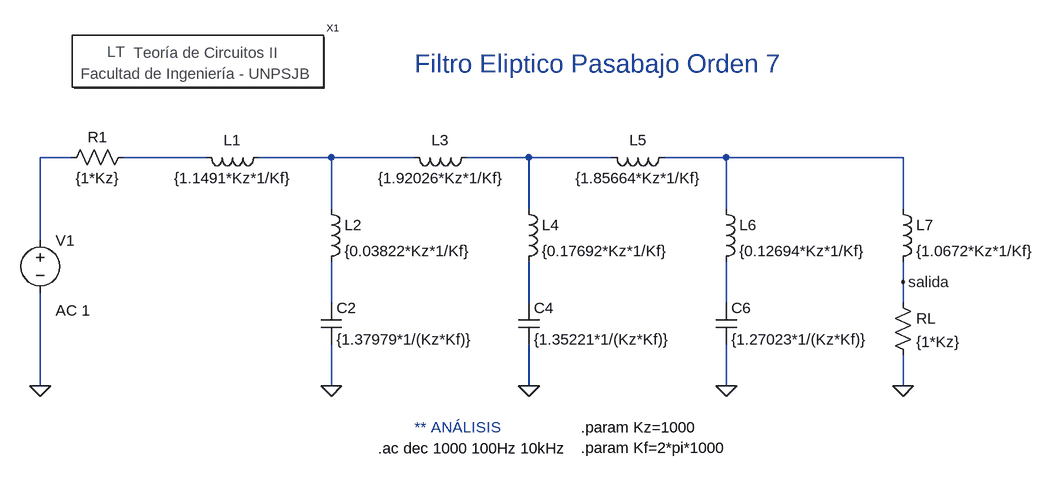
[diagram p0: schematic FiltroElipticoPasabajoOrden7.asc]
FiltroElipticoPasabajoOrden7.asc, the LTspice schematic file:
Version 4
SHEET 1 1536 680
WIRE 16 48 -32 48
WIRE 224 48 96 48
WIRE 416 48 304 48
WIRE 544 48 416 48
WIRE 720 48 624 48
WIRE 848 48 720 48
WIRE 1024 48 928 48
WIRE 1296 48 1024 48
WIRE 416 128 416 48
WIRE 720 128 720 48
WIRE 1024 128 1024 48
WIRE 1296 128 1296 48
WIRE -32 176 -32 48
WIRE 1296 240 1296 208
WIRE 416 272 416 208
WIRE 720 272 720 208
WIRE 1024 272 1024 208
WIRE 1296 272 1296 240
WIRE -32 400 -32 256
WIRE 416 400 416 336
WIRE 720 400 720 336
WIRE 1024 400 1024 336
WIRE 1296 400 1296 352
FLAG 416 400 0
FLAG 720 400 0
FLAG 1024 400 0
FLAG 1296 400 0
FLAG -32 400 0
FLAG 1296 240 salida
SYMBOL voltage -32 160 R0
WINDOW 123 24 124 Left 2
WINDOW 39 0 0 Left 0
SYMATTR InstName V1
SYMATTR Value ""
SYMATTR Value2 AC 1
SYMBOL res 112 32 R90
WINDOW 0 0 56 VBottom 2
WINDOW 3 32 56 VTop 2
SYMATTR InstName R1
SYMATTR Value {1*Kz}
SYMBOL ind 320 32 R90
WINDOW 0 5 56 VBottom 2
WINDOW 3 32 56 VTop 2
SYMATTR InstName L1
SYMATTR Value {1.1491*Kz*1/Kf}
SYMBOL ind 400 112 R0
SYMATTR InstName L2
SYMATTR Value {0.03822*Kz*1/Kf}
SYMBOL cap 400 272 R0
SYMATTR InstName C2
SYMATTR Value {1.37979*1/(Kz*Kf)}
SYMBOL ind 640 32 R90
WINDOW 0 5 56 VBottom 2
WINDOW 3 32 56 VTop 2
SYMATTR InstName L3
SYMATTR Value {1.92026*Kz*1/Kf}
SYMBOL ind 704 112 R0
SYMATTR InstName L4
SYMATTR Value {0.17692*Kz*1/Kf}
SYMBOL cap 704 272 R0
SYMATTR InstName C4
SYMATTR Value {1.35221*1/(Kz*Kf)}
SYMBOL ind 944 32 R90
WINDOW 0 5 56 VBottom 2
WINDOW 3 32 56 VTop 2
SYMATTR InstName L5
SYMATTR Value {1.85664*Kz*1/Kf}
SYMBOL ind 1008 112 R0
SYMATTR InstName L6
SYMATTR Value {0.12694*Kz*1/Kf}
SYMBOL cap 1008 272 R0
SYMATTR InstName C6
SYMATTR Value {1.27023*1/(Kz*Kf)}
SYMBOL ind 1280 112 R0
SYMATTR InstName L7
SYMATTR Value {1.0672*Kz*1/Kf}
SYMBOL res 1280 256 R0
SYMATTR InstName RL
SYMATTR Value {1*Kz}
SYMBOL Circuitos2\\Letreros\\Teoría\ de\ Circuitos\ II 208 -96 R0
SYMATTR InstName X1
TEXT 544 -96 Left 4 ;Filtro Eliptico Pasabajo Orden 7
TEXT 544 464 Left 2 ;** ANÁLISIS
TEXT 488 496 Left 2 !.ac dec 1000 100Hz 10kHz
TEXT 800 464 Left 2 !.param Kz=1000\n.param Kf=2*pi*1000

The netlist it stands for:
* FiltroElipticoPasabajoOrden7.asc
V1 N001 0 AC 1
R1 N002 N001 {1*Kz}
L1 N003 N002 {1.1491*Kz*1/Kf}
L2 N003 N006 {0.03822*Kz*1/Kf}
C2 N006 0 {1.37979*1/(Kz*Kf)}
L3 N004 N003 {1.92026*Kz*1/Kf}
L4 N004 N007 {0.17692*Kz*1/Kf}
C4 N007 0 {1.35221*1/(Kz*Kf)}
L5 N005 N004 {1.85664*Kz*1/Kf}
L6 N005 N008 {0.12694*Kz*1/Kf}
C6 N008 0 {1.27023*1/(Kz*Kf)}
L7 N005 salida {1.0672*Kz*1/Kf}
RL salida 0 {1*Kz}
XX1 Teoría de Circuitos II
* Filtro Eliptico Pasabajo Orden 7
* ** ANÁLISIS
.ac dec 1000 100Hz 10kHz
.param Kz=1000
.param Kf=2*pi*1000
.backanno
.end